# Altium schematic sheet Tiresias_Cover_letter.SchDoc: Tiresias Cover Letter
size 393 x 281 mm; Author: João Victor Colombari Carlet; CompanyName: GMETA; DrawnBy: João Victor Colombari Carlet; Organization: GMETA; Address1: EESC - USP; Address2: 400, Trabalhador São-Carlense Av.; Address3: 13566-590, São Carlos; Address4: São Paulo, Brazil; Revision: 0; SheetNumber: 1; SheetTotal: 5; Company: USP - GMETA; Address_Website: http://www.sel.eesc.usp.br/jcarmo/metamaterials/
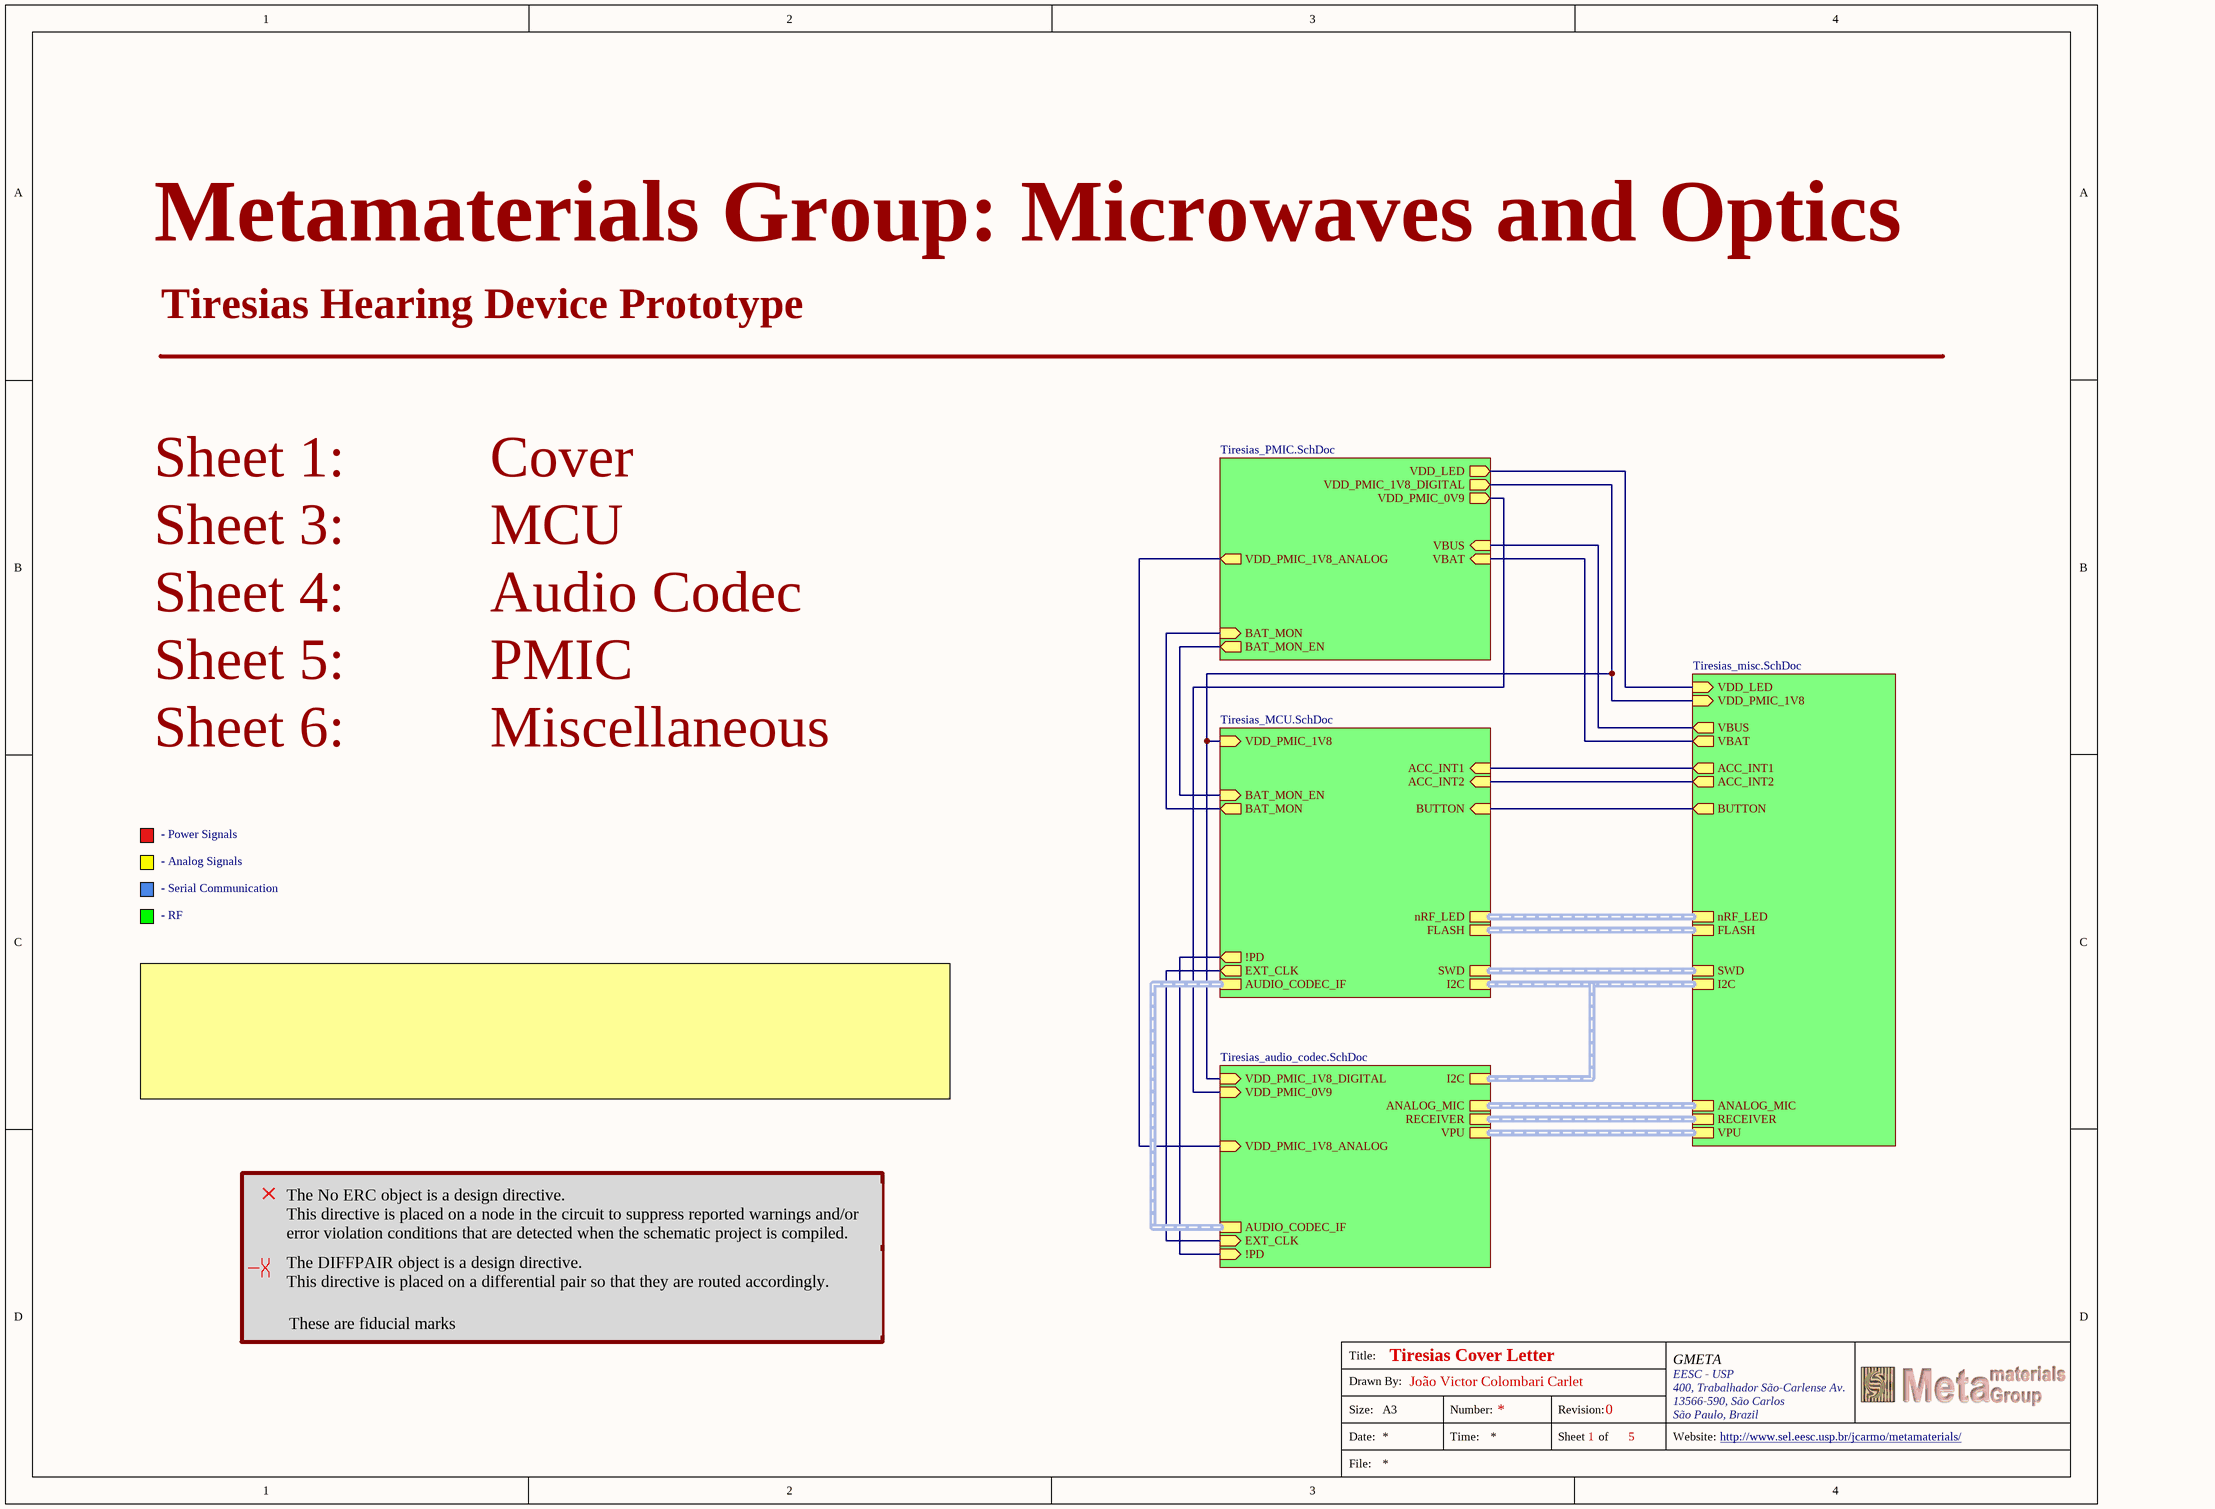
[diagram p0: Tiresias_Cover_letter.SchDoc]

## Sub-sheets
U_Tiresias_audio_codec = Tiresias_audio_codec.SchDoc: RECEIVER (harness RECEIVER), ANALOG_MIC (harness ANALOG_MIC), VPU (harness VPU), AUDIO_CODEC_IF (harness AUDIO_CODEC), I2C (harness I2C), EXT_CLK (in), VDD_PMIC_0V9 (in), !PD (in), VDD_PMIC_1V8_ANALOG (in), VDD_PMIC_1V8_DIGITAL (in)
U_Tiresias_MCU = Tiresias_MCU.SchDoc: SWD (harness SWD), FLASH (harness FLASH), AUDIO_CODEC_IF (harness AUDIO_CODEC), BUTTON (in), VDD_PMIC_1V8 (in), !PD (out), ACC_INT1 (in), ACC_INT2 (in), I2C (harness I2C), EXT_CLK (out), nRF_LED (harness nRF_LED), BAT_MON (out), BAT_MON_EN (in)
U_Tiresias_misc = Tiresias_misc.SchDoc: FLASH (harness FLASH), SWD (harness SWD), BUTTON (out), RECEIVER (harness RECEIVER), ANALOG_MIC (harness ANALOG_MIC), VPU (harness VPU), nRF_LED (harness nRF_LED), VDD_LED (in), ACC_INT1 (out), ACC_INT2 (out), I2C (harness I2C), VBUS (out), VBAT (out), VDD_PMIC_1V8 (in)
U_Tiresias_PMIC = Tiresias_PMIC.SchDoc: VBUS (in), VBAT (in), BAT_MON_EN (out), BAT_MON (in), VDD_LED (out), VDD_PMIC_0V9 (out), VDD_PMIC_1V8_DIGITAL (out), VDD_PMIC_1V8_ANALOG (out)

## Nets
(unnamed): sheet U_Tiresias_MCU/BUTTON, sheet U_Tiresias_misc/BUTTON
(unnamed): sheet U_Tiresias_MCU/VDD_PMIC_1V8, sheet U_Tiresias_audio_codec/VDD_PMIC_1V8_DIGITAL, sheet U_Tiresias_PMIC/VDD_PMIC_1V8_DIGITAL, sheet U_Tiresias_misc/VDD_PMIC_1V8
(unnamed): sheet U_Tiresias_MCU/!PD, sheet U_Tiresias_audio_codec/!PD
(unnamed): sheet U_Tiresias_MCU/ACC_INT1, sheet U_Tiresias_misc/ACC_INT1
(unnamed): sheet U_Tiresias_MCU/ACC_INT2, sheet U_Tiresias_misc/ACC_INT2
(unnamed): sheet U_Tiresias_MCU/EXT_CLK, sheet U_Tiresias_audio_codec/EXT_CLK
(unnamed): sheet U_Tiresias_MCU/BAT_MON, sheet U_Tiresias_PMIC/BAT_MON
(unnamed): sheet U_Tiresias_MCU/BAT_MON_EN, sheet U_Tiresias_PMIC/BAT_MON_EN
(unnamed): sheet U_Tiresias_audio_codec/VDD_PMIC_0V9, sheet U_Tiresias_PMIC/VDD_PMIC_0V9
(unnamed): sheet U_Tiresias_audio_codec/VDD_PMIC_1V8_ANALOG, sheet U_Tiresias_PMIC/VDD_PMIC_1V8_ANALOG
(unnamed): sheet U_Tiresias_PMIC/VBUS, sheet U_Tiresias_misc/VBUS
(unnamed): sheet U_Tiresias_PMIC/VBAT, sheet U_Tiresias_misc/VBAT
(unnamed): sheet U_Tiresias_PMIC/VDD_LED, sheet U_Tiresias_misc/VDD_LED

## Buses and harness runs
harness sheet U_Tiresias_audio_codec/ANALOG_MIC = sheet U_Tiresias_misc/ANALOG_MIC
harness sheet U_Tiresias_audio_codec/AUDIO_CODEC_IF = sheet U_Tiresias_MCU/AUDIO_CODEC_IF
harness sheet U_Tiresias_audio_codec/I2C = sheet U_Tiresias_MCU/I2C = sheet U_Tiresias_misc/I2C
harness sheet U_Tiresias_audio_codec/RECEIVER = sheet U_Tiresias_misc/RECEIVER
harness sheet U_Tiresias_audio_codec/VPU = sheet U_Tiresias_misc/VPU
harness sheet U_Tiresias_MCU/FLASH = sheet U_Tiresias_misc/FLASH
harness sheet U_Tiresias_MCU/nRF_LED = sheet U_Tiresias_misc/nRF_LED
harness sheet U_Tiresias_MCU/SWD = sheet U_Tiresias_misc/SWD

## Layout directives
differential pair: (no net found under the mark)

## Notes on the sheet
- Metamaterials Group: Microwaves and Optics
- Tiresias Hearing Device Prototype
- Sheet 1:          Cover
- Sheet 3:          MCU
- Sheet 4:          Audio Codec
- Sheet 5:          PMIC
- Sheet 6:          Miscellaneous
- - Power Signals
- - Analog Signals
- - Serial Communication
- - RF
- The No ERC object is a design directive.
  This directive is placed on a node in the circuit to suppress reported warnings and/or error violation conditions that are detected when the schematic project is compiled.
- The DIFFPAIR object is a design directive.
  This directive is placed on a differential pair so that they are routed accordingly.
- These are fiducial marks
- Title:
- Drawn By:
- Size:
- Date:
- File:
- A3
- Number:
- Time:
- Revision:
- Sheet
- of
- Website: